# Altium schematic sheet MCU_SIM.SchDoc
size A; SheetNumber: 4; SheetTotal: 10
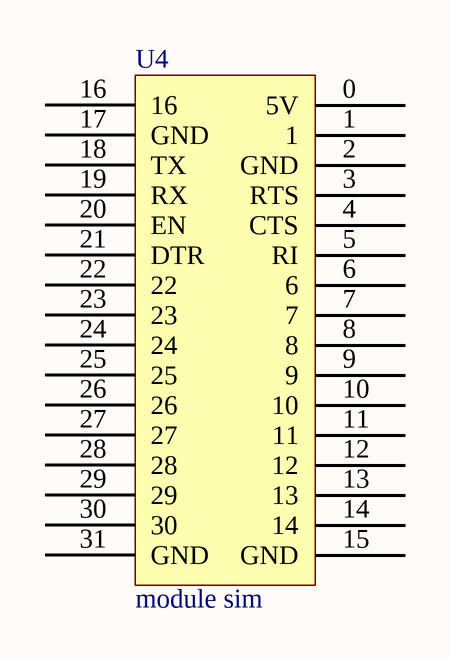
[diagram p0: MCU_SIM.SchDoc]

## Parts
U4  module sim  [SIM7600CE]

## Nets

Not connected (* = marked no-connect by the designer): U4 0(5V) 1 2(GND) 3(RTS) 4(CTS) 5(RI) 6 7 8 9 10 11 12 13 14 15(GND) 16 17(GND) 18(TX) 19(RX) 20(EN) 21(DTR) 22 23 24 25 26 27 28 29 30 31(GND)

## Library data of the parts
U4 = Module SIM7600CE